# EAGLE schematic Ismailabi2 (EAGLE 9.6.2)
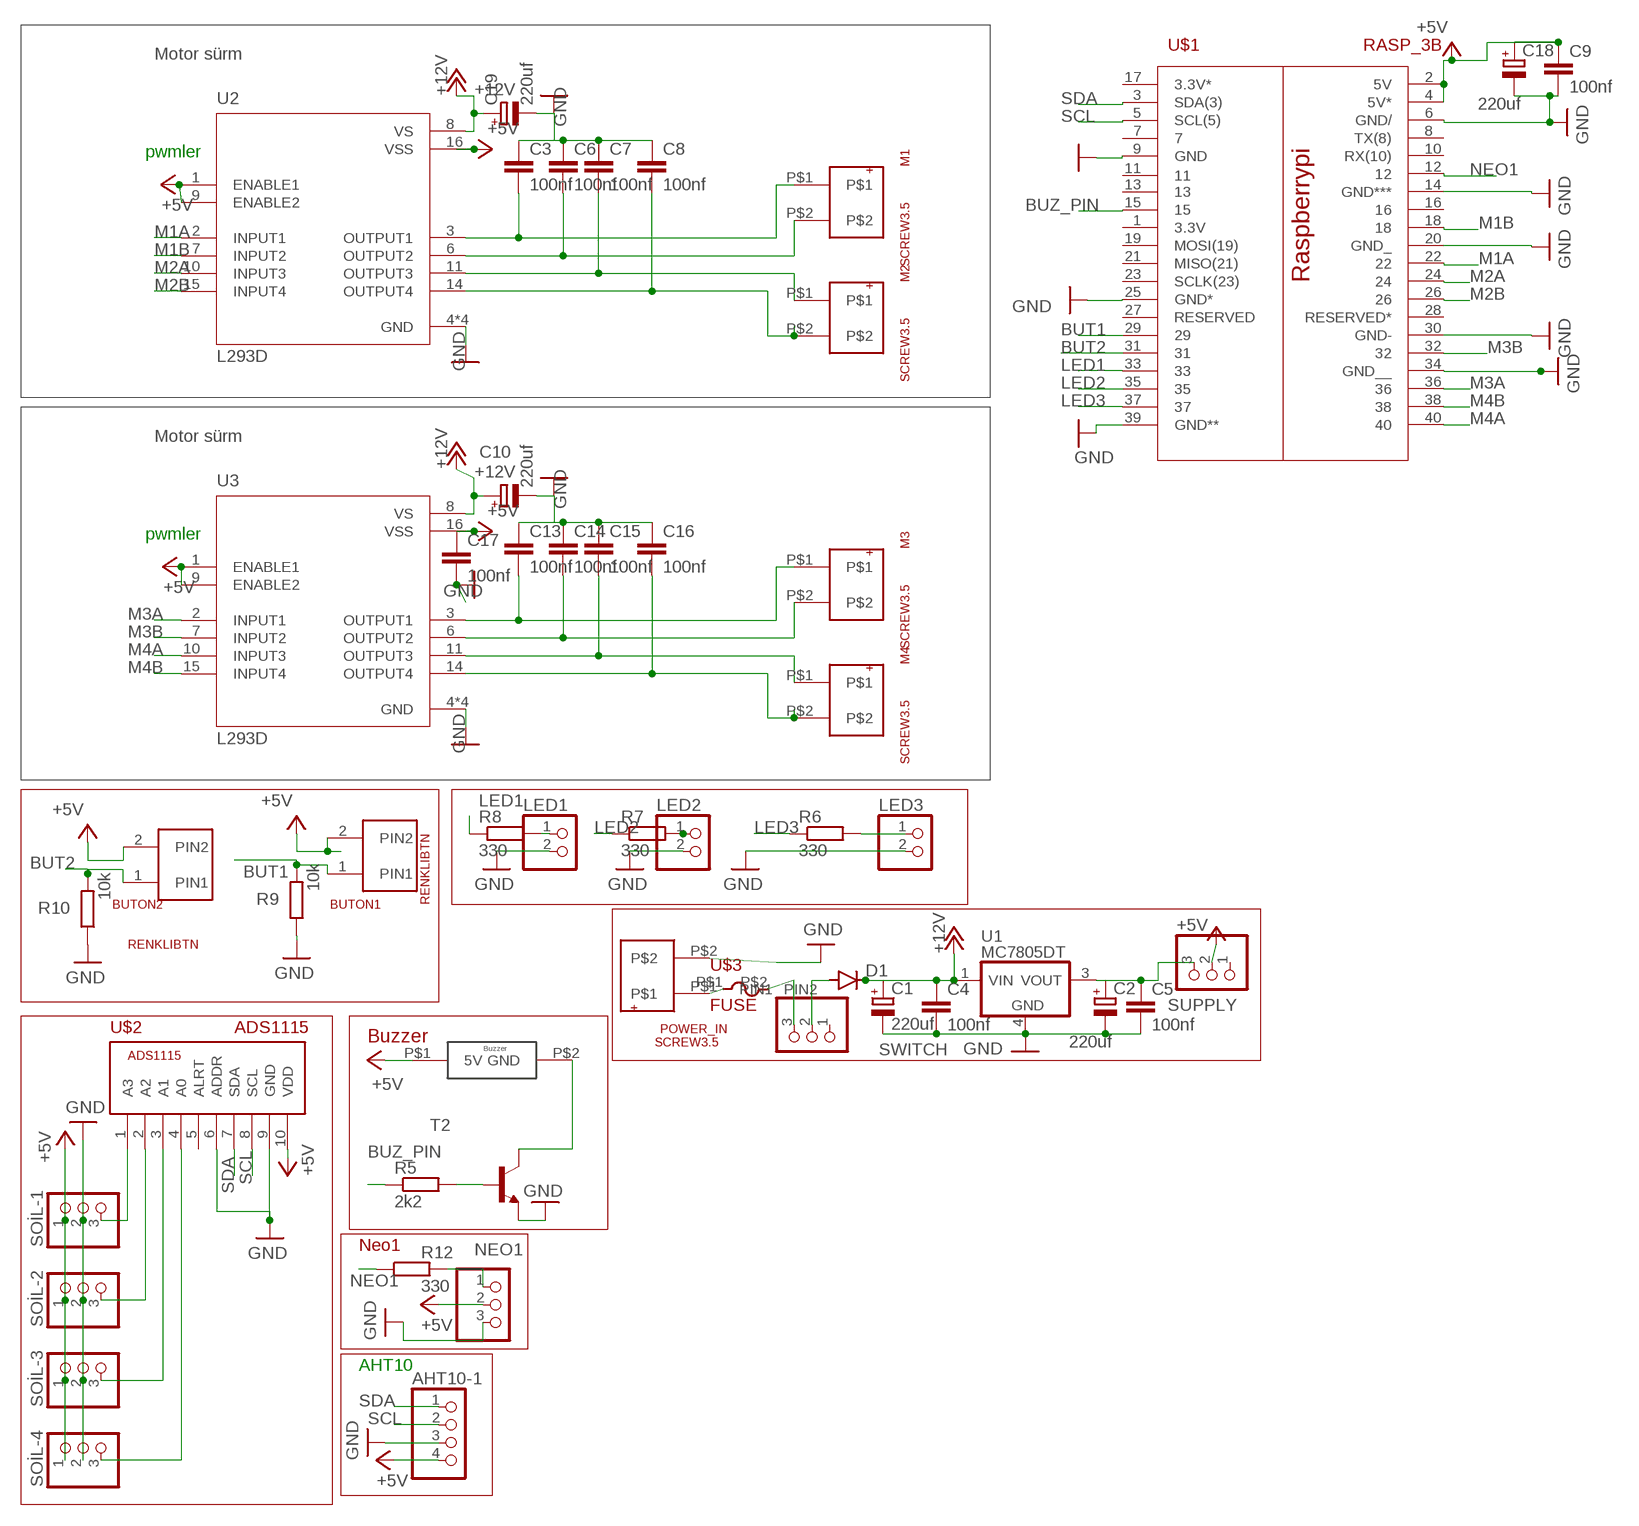
[diagram p0: schematic, sheet 1]

## Parts
AHT10-1  PINHD-1X4  [1X04]
BUTON1  RENKLIBTN  [BTN]
BUTON2  RENKLIBTN  [BTN]
C1  220uf  CPOL-EU153CLV-0605  [153CLV-0605]
C2  220uf  CPOL-EU153CLV-0605  [153CLV-0605]
C3  100nf  C-EUC0603  [C0603]
C4  100nf  C-EUC0603  [C0603]
C5  100nf  C-EUC0603  [C0603]
C6  100nf  C-EUC0603  [C0603]
C7  100nf  C-EUC0603  [C0603]
C8  100nf  C-EUC0603  [C0603]
C9  100nf  C-EUC0603  [C0603]
C10  220uf  CPOL-EU153CLV-0605  [153CLV-0605]
C13  100nf  C-EUC0603  [C0603]
C14  100nf  C-EUC0603  [C0603]
C15  100nf  C-EUC0603  [C0603]
C16  100nf  C-EUC0603  [C0603]
C17  100nf  C-EUC0603  [C0603]
C18  220uf  CPOL-EU153CLV-0605  [153CLV-0605]
C19  220uf  CPOL-EU153CLV-0605  [153CLV-0605]
D1  DIODE-DO-214AC  [DO-214AC]
LED1  PINHD-1X2  [1X02]
LED2  PINHD-1X2  [1X02]
LED3  PINHD-1X2  [1X02]
M1  SCREW3.5  [CREWT]
M2  SCREW3.5  [CREWT]
M3  SCREW3.5  [CREWT]
M4  SCREW3.5  [CREWT]
NEO1  PINHD-1X3  [1X03]
POWER_IN  SCREW3.5  [CREWT]
R5  2k2  R-EU_R0805  [R0805]
R6  330  R-EU_R0805  [R0805]
R7  330  R-EU_R0805  [R0805]
R8  330  R-EU_R0805  [R0805]
R9  10k  R-EU_R0805  [R0805]
R10  10k  R-EU_R0805  [R0805]
R12  330  R-EU_R0805  [R0805]
SOİL-1  PINHD-1X3  [1X03]
SOİL-2  PINHD-1X3  [1X03]
SOİL-3  PINHD-1X3  [1X03]
SOİL-4  PINHD-1X3  [1X03]
SUPPLY  PINHD-1X3  [1X03]
SWITCH  PINHD-1X3  [1X03]
T2  2N2222-NPN-TO92-EBC  [TO92-EBC]
U1  MC7805DT  [DPAK-3]
U2  L293D  [DIP880W50P254L2000H510Q16]
U3  L293D  [DIP880W50P254L2000H510Q16]
U$1  RASP_3B  [PI3B+]
U$2  ADS1115  [ADS1115]
U$3  FUSE  [FUSE]
U$4  BUZZER  [BUZZER]

## Nets
+5V: AHT10-1.4 BUTON1.2(PIN2) BUTON2.2(PIN2) C9.1 C17.1 C18.+ NEO1.2 SOİL-1.1 SOİL-2.1 SOİL-3.1 SOİL-4.1 SUPPLY.2 U2.1(ENABLE1) U2.9(ENABLE2) U2.16(VSS) U3.1(ENABLE1) U3.9(ENABLE2) U3.16(VSS) U$1.2(5V) U$1.4(5V*) U$2.10(VDD) U$4.P$1(5V)
+12V: C1.+ C4.1 C10.+ C19.+ D1.C U1.1(VIN) U2.8(VS) U3.8(VS)
BUT1: BUTON1.1(PIN1) R9.2 U$1.29
BUT2: BUTON2.1(PIN1) R10.2 U$1.31
BUZ_PIN: R5.1 U$1.15
GND: AHT10-1.3 C1.- C2.- C3.1 C4.2 C5.2 C6.1 C7.1 C8.1 C9.2 C10.- C13.1 C14.1 C15.1 C16.1 C17.2 C18.- C19.- LED1.2 LED2.2 LED3.2 NEO1.3 POWER_IN.P$2 R9.1 R10.1 SOİL-1.2 SOİL-2.2 SOİL-3.2 SOİL-4.2 T2.E U1.4(GND) U2.4(GND) U2.5(GND) U2.12(GND) U2.13(GND) U3.4(GND) U3.5(GND) U3.12(GND) U3.13(GND) U$1.6(GND/) U$1.9(GND) U$1.14(GND***) U$1.20(GND_) U$1.25(GND*) U$1.30(GND-) U$1.34(GND__) U$1.39(GND**) U$2.6(ADDR) U$2.9(GND)
LED1: R8.1 U$1.33
LED2: R7.1 U$1.35
LED3: R6.1 U$1.37
M1A: U2.2(INPUT1) U$1.22
M1B: U2.7(INPUT2) U$1.18
M2A: U2.10(INPUT3) U$1.24
M2B: U2.15(INPUT4) U$1.26
M3A: U3.2(INPUT1) U$1.36
M3B: U3.7(INPUT2) U$1.32
M4A: U3.10(INPUT3) U$1.40
M4B: U3.15(INPUT4) U$1.38
N$1: SOİL-1.3 U$2.1(A3)
N$2: SOİL-2.3 U$2.2(A2)
N$3: SOİL-3.3 U$2.3(A1)
N$4: SWITCH.3 U$3.P$2(PIN2)
N$5: SOİL-4.3 U$2.4(A0)
N$6: POWER_IN.P$1 U$3.P$1(PIN1)
N$7: R5.2 T2.B
N$8: T2.C U$4.P$2(GND)
N$9: C3.2 M1.P$1 U2.3(OUTPUT1)
N$11: D1.A SWITCH.2
N$12: C6.2 M1.P$2 U2.6(OUTPUT2)
N$13: C8.2 M2.P$2 U2.14(OUTPUT4)
N$14: C7.2 M2.P$1 U2.11(OUTPUT3)
N$15: C13.2 M3.P$1 U3.3(OUTPUT1)
N$16: C14.2 M3.P$2 U3.6(OUTPUT2)
N$17: C16.2 M4.P$2 U3.14(OUTPUT4)
N$18: LED3.1 R6.2
N$19: LED2.1 R7.2
N$20: LED1.1 R8.2
N$21: C15.2 M4.P$1 U3.11(OUTPUT3)
N$24: NEO1.1 R12.2
NEO1: R12.1 U$1.12
SCL: AHT10-1.2 U$1.5(SCL(5)) U$2.8(SCL)
SDA: AHT10-1.1 U$1.3(SDA(3)) U$2.7(SDA)
VOUT: C2.+ C5.1 SUPPLY.3 U1.3(VOUT)
Unconnected: SUPPLY.1 SWITCH.1 U$1.1(3.3V) U$1.7 U$1.8(TX(8)) U$1.10(RX(10)) U$1.11 U$1.13 U$1.16 U$1.17(3.3V*) U$1.19(MOSI(19)) U$1.21(MISO(21)) U$1.23(SCLK(23)) U$1.27(RESERVED) U$1.28(RESERVED*) U$2.5(ALRT)

## Notes on the sheet
- Motor sürm
- pwmler
- Motor sürm
- pwmler
- Buzzer
- Neo1
- AHT10

## Library data of the parts
AHT10-1 = pinhead:PINHD-1X4: PIN HEADER
BUTON1 BUTON2 = renkli_btn:RENKLIBTN
C1 C2 C10 C18 C19 = rcl:CPOL-EU: POLARIZED CAPACITOR, European symbol; SPICEPREFIX: C
C3-C9 C13-C17 = rcl:C-EU: CAPACITOR, European symbol; SPICEPREFIX: C
D1 = diode:DIODE-: DIODE
LED1-LED3 = pinhead:PINHD-1X2: PIN HEADER
M1-M4 POWER_IN = screw:SCREW3.5
NEO1 SOİL-1-SOİL-4 SUPPLY SWITCH = pinhead:PINHD-1X3: PIN HEADER
R5-R10 R12 = rcl:R-EU_: RESISTOR, European symbol; SPICEPREFIX: R
T2 = transistor-neu-to92:*-NPN-: NPN Transistror
U1 = _hhn_78xx_79xx_NCV78xx_d2pak_dpak (1):MC78*: 78xx SMD (D2PAK, DPAK) (MC)78xx..DT (DPAK-3; Rth,JA = 92 K/W) (MC)78xx..D2T (D2PAK-3; Rth,JA = 45 K/W @ 10x10mm copper area) Linear Voltage Regulators, Positive, 1 A (ON Semiconductor) Package dimenisions and soldering footprints acc. to ONSEMI specs. Source: http://onsemi.com Datasheet document#: MC7800/D Technologies: 78xxyD(2)Tz: xx = Output Voltage (V) y, z: additional suffixes see manufacturer's datasheet Author: Dipl.-Ing. FH Rainer Bayer HHN Hochschule Heilbronn, rainer.bayer@hs-heilbronn.de Ingenieurbüro ing-rb, mail@ing-rb.de
U2 U3 = L293D:L293D: 4-Channel Motor Driver 24V 16-Pin Power PDIP Tube Check prices <https://snapeda.com/parts/L293D/STMicroelectronics/view-part/?ref=eda>; ARROW_ELECTRONICS-PURCHASE-URL: https://snapeda.com/shop?store=Arrow+Electronics&id=3077057; ARROW_EUROPE-PURCHASE-URL: https://snapeda.com/shop?store=Arrow+Europe&id=3077057; AVAILABILITY: Good; DESCRIPTION: Bipolar Motor Driver Parallel 20-SOIC; DIGIKEY-PURCHASE-URL: https://snapeda.com/shop?store=DigiKey&id=3077057; MF: STMicroelectronics; MOUSER-PURCHASE-URL: https://snapeda.com/shop?store=Mouser&id=3077057; MP: L293D; PACKAGE: DIP-16 STMicroelectronics; PRICE: None
U$1 = Raspberry_pi:RASP_3B
U$2 = Ads115:ADS1115
U$3 = fuse:FUSE: 2410 fuse package
U$4 = buzzer:BUZZER